# EAGLE schematic FOBOS_circuit (EAGLE 6.4)
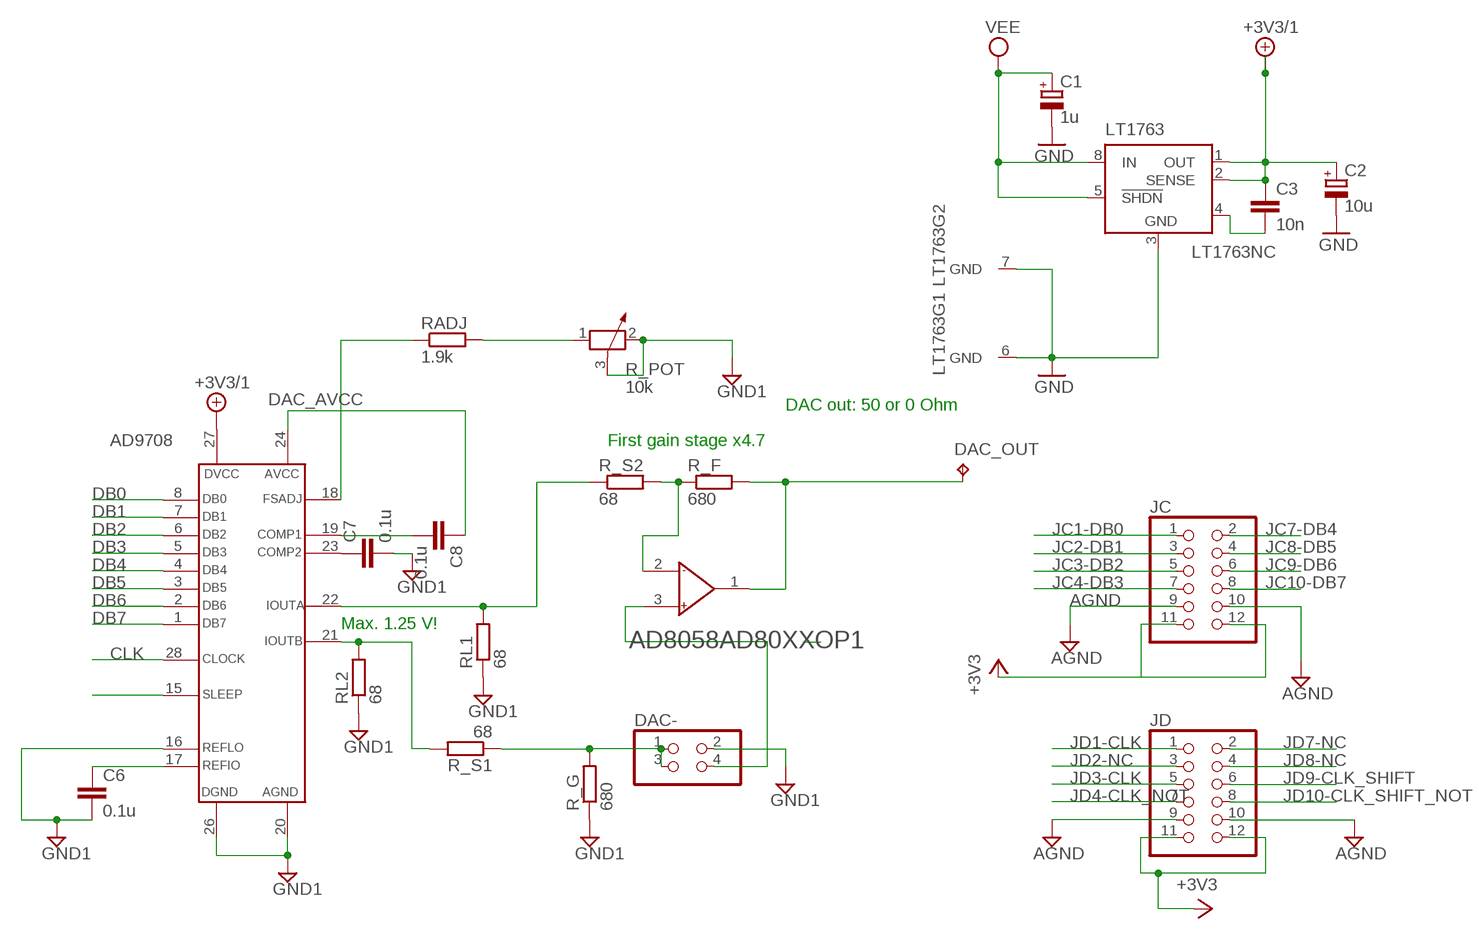
[diagram p0: schematic, sheet 1]

## Parts
AD8058  AD80XX  [SO08]
AD9708  AD7908  [SO28W]
C1  1u  CPOL-EUSMCC  [SMC_C]
C2  10u  CPOL-EUSMCC  [SMC_C]
C3  10n  C-EUC1206  [C1206]
C6  0.1u  C-EUC1206  [C1206]
C7  0.1u  C-EUC1206  [C1206]
C8  0.1u  C-EUC1206  [C1206]
DAC-  PINHD-2X2  [2X02]
DAC_OUT  DAC_OUT  TPPAD1-13  [P1-13]
JC  PINHD-2X6  [2X06]
JD  PINHD-2X6  [2X06]
LT1763  LT1129CS8  [SOIC8]
R_F  680  R-EU_R1206  [R1206]
R_G  680  R-EU_R1206  [R1206]
R_POT  10k  POTENTIOMETER_PT_SPIN  [PT-SPIN]
R_S1  68  R-EU_R1206  [R1206]
R_S2  68  R-EU_R1206  [R1206]
RADJ  1.9k  R-EU_R1206  [R1206]
RL1  68  R-EU_R1206  [R1206]
RL2  68  R-EU_R1206  [R1206]

## Nets
+3V3: JC.11 JC.12 JD.11 JD.12
+5V/1: AD9708.27(DVCC) C2.+ C3.1 LT1763.1(OUT) LT1763.2(SENSE) ; supply symbol labelled +3V3/1
AGND: JC.9 JC.10 JD.9 JD.10
CLK: AD9708.28(CLOCK)
DAC_AVCC: AD9708.24(AVCC) C8.1
DB0: AD9708.8(DB0)
DB1: AD9708.7(DB1)
DB2: AD9708.6(DB2)
DB3: AD9708.5(DB3)
DB4: AD9708.4(DB4)
DB5: AD9708.3(DB5)
DB6: AD9708.2(DB6)
DB7: AD9708.1(DB7)
GND: C1.- C2.- LT1763.3(GND) LT1763.6(GND) LT1763.7(GND)
GND1: AD9708.16(REFLO) AD9708.20(AGND) AD9708.26(DGND) C6.2 C7.2 DAC-.2 R_G.1 R_POT.2 R_POT.3 RL1.1 RL2.1
JC1-DB0: JC.1
JC2-DB1: JC.3
JC3-DB2: JC.5
JC4-DB3: JC.7
JC7-DB4: JC.2
JC8-DB5: JC.4
JC9-DB6: JC.6
JC10-DB7: JC.8
JD1-CLK: JD.1
JD2-NC: JD.3
JD3-CLK: JD.5
JD4-CLK_NOT: JD.7
JD7-NC: JD.2
JD8-NC: JD.4
JD9-CLK_SHIFT: JD.6
JD10-CLK_SHIFT_NOT: JD.8
N$2: AD9708.15(SLEEP)
N$7: C3.2 LT1763.4(NC)
N$10: DAC-.1 DAC-.3 R_G.2 R_S1.1
N$11: AD8058.2(AD80XXOP1:IN-) R_F.1 R_S2.2
N$12: AD8058.1(AD80XXOP1:OUT) DAC_OUT.TP R_F.2
N$13: AD9708.17(REFIO) C6.1
N$14: AD9708.23(COMP2) C7.1
N$15: AD9708.19(COMP1) C8.2
N$16: AD9708.18(FSADJ) RADJ.1
N$17: AD8058.3(AD80XXOP1:IN+) DAC-.4
N$19: R_POT.1 RADJ.2
N$22: AD9708.21(IOUTB) R_S1.2 RL2.2
N$24: AD9708.22(IOUTA) R_S2.1 RL1.2
VEE: C1.+ LT1763.5(!SHDN) LT1763.8(IN)
Unconnected: AD8058.4(SUPPLY:VCC-) AD8058.5(AD80XXOP2:IN+) AD8058.6(AD80XXOP2:IN-) AD8058.7(AD80XXOP2:OUT) AD8058.8(SUPPLY:VCC+)

## Notes on the sheet
- DAC out: 50 or 0 Ohm
- First gain stage x4.7
- Max. 1.25 V!

## Library data of the parts
AD8058 = ad80xx:AD80XX: AD high bandwidth dual opamp
AD9708 = ad9708:AD7908: AD9708 8-Bit DAC with current output http://www.analog.com/static/imported-files/data_sheets/AD9708.pdf
C1 C2 = rcl:CPOL-EU: POLARIZED CAPACITOR, European symbol
C3 C6-C8 = rcl:C-EU: CAPACITOR, European symbol
DAC- = pinhead:PINHD-2X2: PIN HEADER
DAC_OUT = testpad:TP: Test pad
JC = pinhead:PINHD-2X6: PIN HEADER; DIGIKEY#: 609-3373-ND
JD = pinhead:PINHD-2X6: PIN HEADER
LT1763 = linear-technology:LT1129CS8: VOLTAGE REGULATOR with shutdown
R_F R_G R_S1 R_S2 RADJ RL1 RL2 = rcl:R-EU_: RESISTOR, European symbol
R_POT = rcl:POTENTIOMETER_: Potentiometer